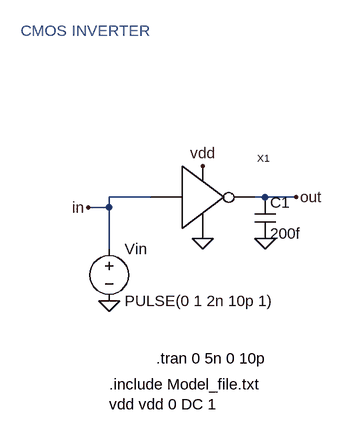
[diagram p0: schematic invertersim_tran.asc]
invertersim_tran.asc, the LTspice schematic file:
Version 4
SHEET 1 880 680
WIRE 128 96 64 96
WIRE 304 96 288 96
WIRE 352 96 304 96
WIRE 64 112 64 96
WIRE 64 112 32 112
WIRE 64 176 64 112
FLAG 32 112 in
FLAG 352 96 out
FLAG 64 256 0
FLAG 208 160 0
FLAG 208 48 vdd
FLAG 304 160 0
SYMBOL voltage 64 160 R0
WINDOW 123 0 0 Left 0
WINDOW 39 0 0 Left 0
SYMATTR InstName Vin
SYMATTR Value PULSE(0 1 2n 10p 1)
SYMBOL Inverter 176 96 R0
SYMATTR InstName X1
SYMBOL cap 288 96 R0
SYMATTR InstName C1
SYMATTR Value 200f
TEXT 64 384 Left 2 !.include Model_file.txt\nvdd vdd 0 DC 1
TEXT -72 -160 Left 2 ;CMOS INVERTER
TEXT 136 344 Left 2 !.tran 0 5n 0 10p

The netlist it stands for:
* invertersim_tran.asc
Vin in 0 PULSE(0 1 2n 10p 1)
XX1 in out vdd 0 Inverter  ; pins in out vdd DGND
C1 out 0 200f
.include Model_file.txt
vdd vdd 0 DC 1
* CMOS INVERTER
.tran 0 5n 0 10p
.backanno
.end